# EAGLE design power (EAGLE 6.6.0)
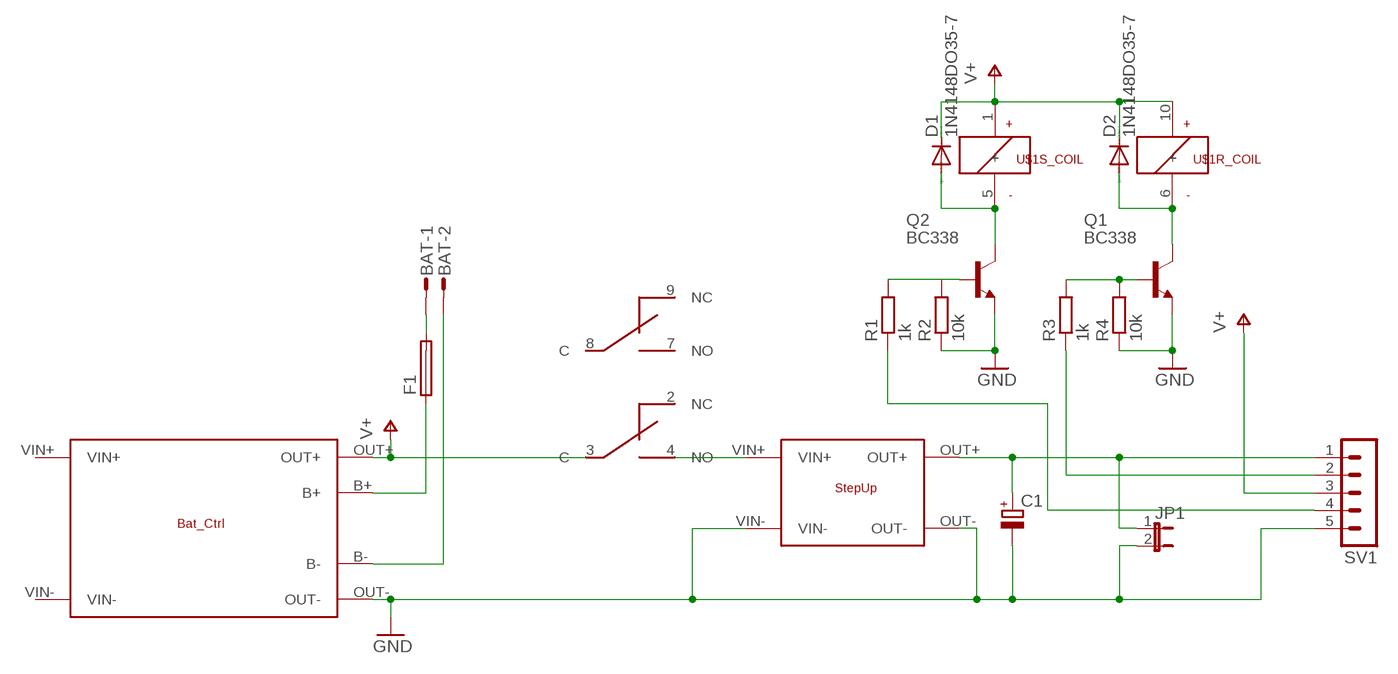
[diagram p0: schematic, sheet 1]

## Parts
BAT  S02P  [S02P]
C1  CPOL-EUE3.5-8  [E3,5-8]
D1  1N4148DO35-7  [DO35-7]
D2  1N4148DO35-7  [DO35-7]
F1  SH22,5  [SH22,5]
JP1  JP1E  [JP1]
Q1  BC338  [TO92-EBC]
Q2  BC338  [TO92-EBC]
R1  1k  R-EU_0204/7  [0204/7]
R2  10k  R-EU_M1206  [M1206]
R3  1k  R-EU_0204/7  [0204/7]
R4  10k  R-EU_M1206  [M1206]
SV1  MA05-1  [MA05-1]
U$1  EB2-4.5TNU  [10PIN_SMD_RELAY]
U$2  STEP_UP  [STEP_UP]
U$3  BAT_CTRL  [BAT_CONTR]

## Nets
GND: C1.- JP1.2 Q1.E Q2.E R2.1 R4.1 SV1.5 U$2.OUT- U$2.VIN- U$3.OUT-
N$1: D2.A Q1.C U$1.6(R_COIL:-)
N$2: D1.A Q2.C U$1.5(S_COIL:-)
N$3: Q2.B R1.2 R2.2
N$4: Q1.B R3.2 R4.2
N$5: BAT.1 F1.2
N$6: F1.1 U$3.B+
N$7: BAT.2 U$3.B-
N$8: U$1.4(SWITCH_TOP:NO) U$2.VIN+
N$9: C1.+ JP1.1 SV1.1 U$2.OUT+
N$11: R3.1 SV1.2
N$12: R1.1 SV1.4
V+: D1.C D2.C SV1.3 U$1.1(S_COIL:+) U$1.3(SWITCH_TOP:C) U$1.10(R_COIL:+) U$3.OUT+
Unconnected: U$1.2(SWITCH_TOP:NC) U$1.7(SWITCH_BOT:NO) U$1.8(SWITCH_BOT:C) U$1.9(SWITCH_BOT:NC) U$3.VIN+ U$3.VIN-

## Library data of the parts
BAT = con-amp-mt:S02P: AMP MT CONNECTOR; OC_FARNELL: unknown; OC_NEWARK: unknown
C1 = resistor:CPOL-EU: POLARIZED CAPACITOR, European symbol
D1 D2 = diode:1N4148: DIODE high speed (Philips)
F1 = fuse:SH22,5: FUSE HOLDER grid 22,5 mm, OGN0031 8201, Schurter (Buerklin); MF: SCHURTER; MPN: 0031.8201; OC_FARNELL: 1162740; OC_NEWARK: 96F8317
JP1 = jumper:JP1E: JUMPER
Q1 Q2 = transistor-npn:BC338*: NPN Transistor
R1-R4 = resistor:R-EU_: RESISTOR, European symbol
SV1 = con-lstb:MA05-1: PIN HEADER; OC_FARNELL: unknown; OC_NEWARK: unknown
U$1 = Mein_zeug:EB2-4.5TNU
U$2 = Mein_zeug:STEP_UP
U$3 = Mein_zeug:BAT_CTRL

## Board
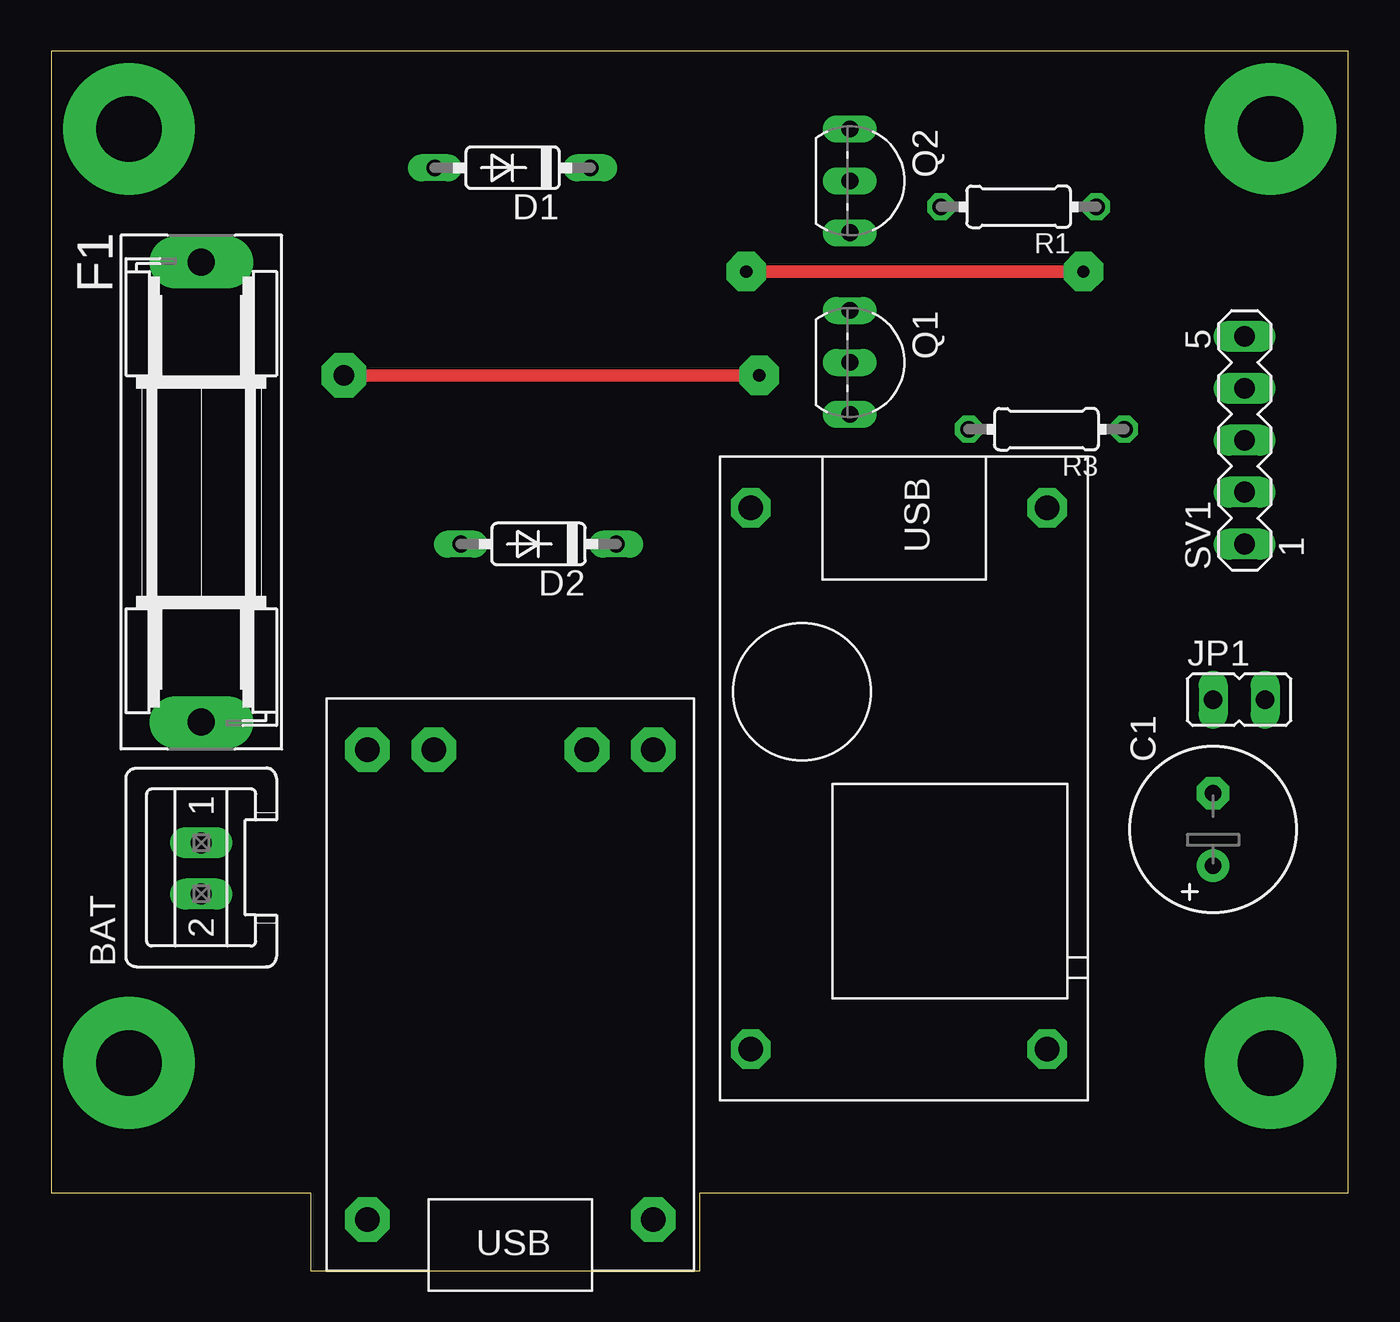
[diagram p1: board, top side]
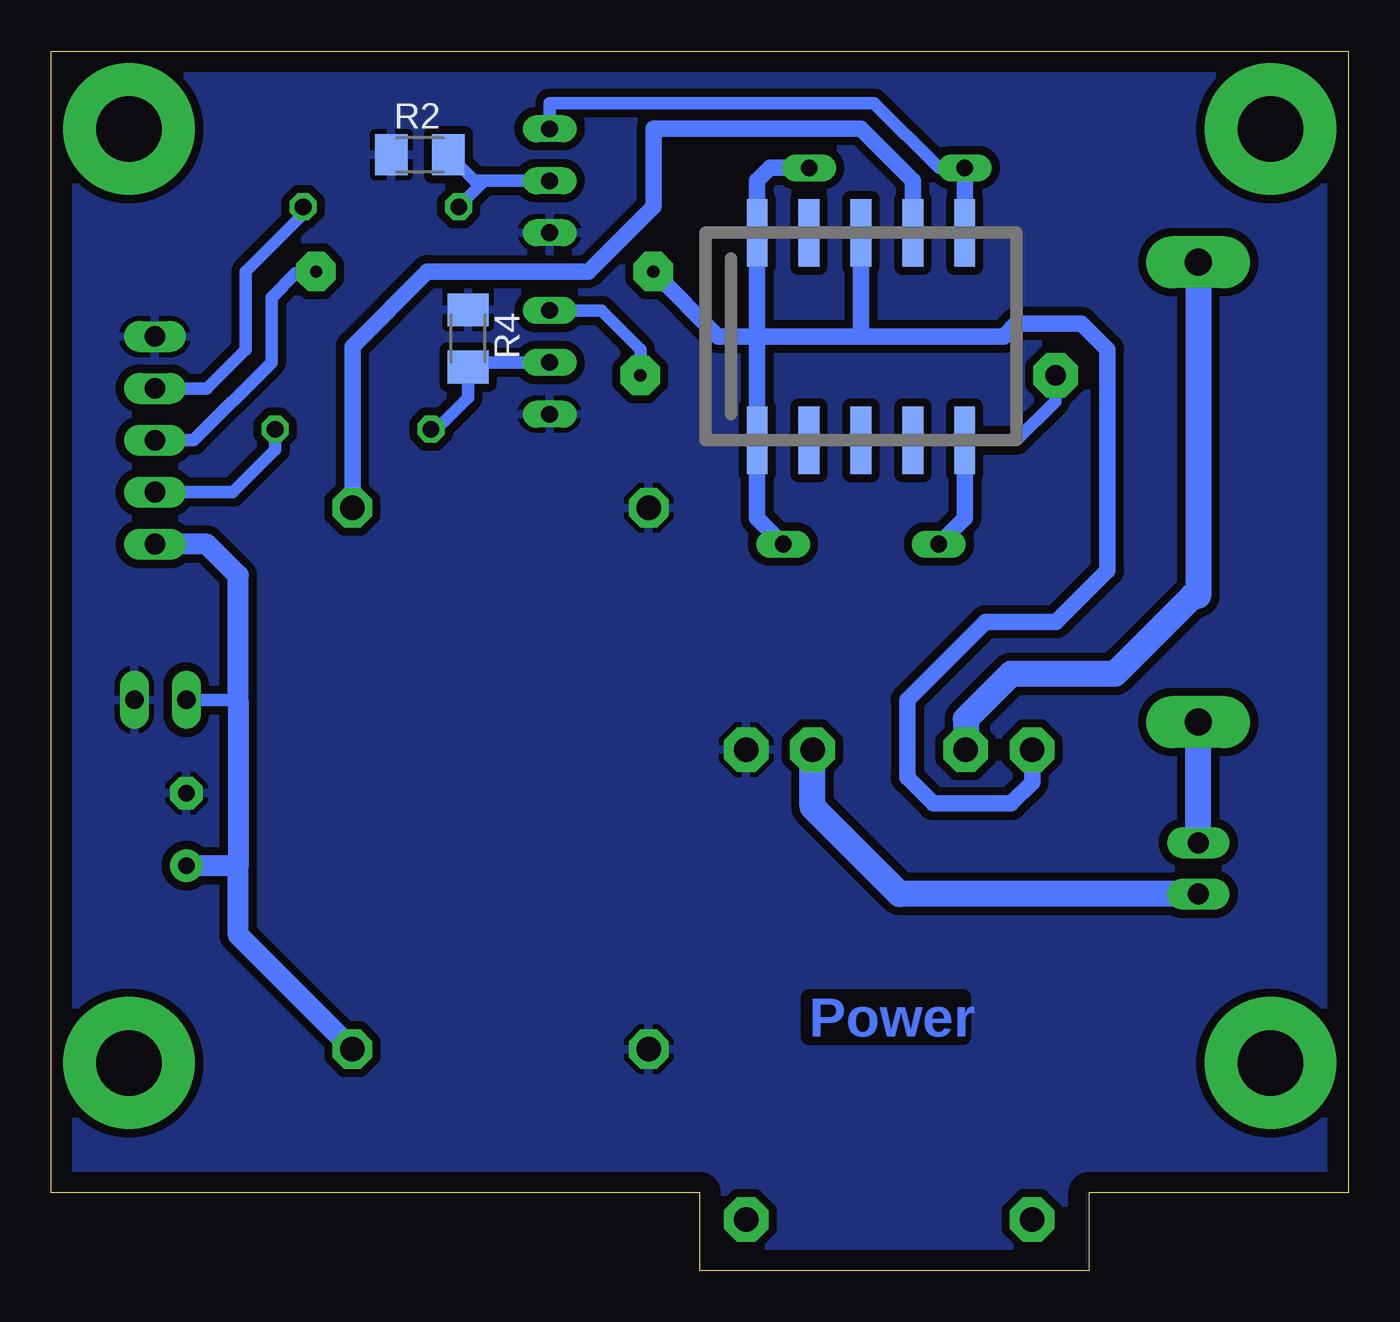
[diagram p2: board, bottom side, seen from below]

Size 63.5 x 59.69 mm. Coordinates in mm from the lower left corner, seen from the top.
Outline: 63.5,3.81 63.5,59.69 0,59.69 0,3.81 12.7,3.81 12.7,0 31.75,0 31.75,3.81 63.5,3.81
Copper layers (1*16): Top 0.035mm / dielectric 1.5mm / Bottom 0.035mm
Design rules "default": minimum track width 10mil, minimum drill 24mil, track to track 8mil, track to pad 8mil, pad to pad 8mil, via to via 8mil, smd to smd 8mil, copper to edge 40mil, drill to drill 8mil, minimum pad ring 10mil, minimum via ring 8mil, stop-mask expansion 4mil, vias tented up to drill 0mil, thermal gap 10mil

### Footprints (pad centres in the part's own frame; a part is rotated, then mirrored left to right if it is on the bottom)
S02P = drill 1.016 long: 1 1.25,0; 2 -1.25,0
E3,5-8 = drill 0.813 pad 1.6: + -1.778,0 | drill 0.813 pad 1.6 octagon: - 1.778,0
DO35-7 = drill 0.813 long: A 3.81,0; C -3.81,0
SH22,5 = drill 1.321 pad 2.54 long: 1 -11.252,0; 2 11.252,0
JP1 = drill 0.914 long: 1 0,-1.27; 2 0,1.27
TO92-EBC = drill 0.813 long: B 0,-1.27; C -2.54,-1.27; E 2.54,-1.27
0204/7 = drill 0.813 octagon: 1 -3.81,0; 2 3.81,0
M1206 = smd 1.6 x 2: 1 -1.4,0; 2 1.4,0
MA05-1 = drill 1.016 long: 1 -5.08,0; 2 -2.54,0; 3 0,0; 4 2.54,0; 5 5.08,0
10PIN_SMD_RELAY = smd 1.016 x 3.302: 1 -5.08,5.08; 2 -2.54,5.08; 3 0,5.08; 4 2.54,5.08; 5 5.08,5.08; 6 5.08,-5.08; 7 2.54,-5.08; 8 0,-5.08; 9 -2.54,-5.08; 10 -5.08,-5.08
STEP_UP = drill 1.2 pad 1.93 octagon: OUT+ 29,16; OUT- 29,1.5; VIN+ 2.5,16; VIN- 2.5,1.5
BAT_CONTR = drill 1.2 pad 2.184 octagon: B+ 25.5,12.75; B- 25.5,5.25; OUT+ 25.5,16; OUT- 25.5,2; VIN+ 2.5,16; VIN- 2.5,2

### Placement (x,y rotation side)
BAT  7.35,19.69 90 top
C1  56.88,21.59 90 top
D1  22.59,53.97 180 top
D2  23.86,35.56 180 top
F1  7.35,38.1 270 top
JP1  58.15,27.94 270 top
Q1  40.37,44.45 270 top
Q2  40.37,53.34 270 top
R1  47.36,52.07 180 top
R2  45.45,54.61 0 bottom
R3  48.72,41.18 180 top
R4  43.09,45.62 270 bottom
SV1  58.42,40.64 90 top
U$1  23.86,45.72 0 bottom
U$2  32.75,39.83 270 top
U$3  31.48,0 90 top

### Tracks (layer width: path | path; a pad name or v marks a point on that pad's centre or on a via)
GND
  pour Bottom (isolate 0.406): 0,0 63.5,0 63.5,59.69 0,59.69
N$1  (via drill 0.6 pad 1.93, 1 pad 2.18)
  Top 0.61: v34.66,43.81 v14.34,43.81
  Bottom 0.61: U$1.6 16.24,40.64 14.34,42.55 v14.34,43.81 | Q1.C 36.56,46.99 34.66,45.08 v34.66,43.81
  Bottom 0.813: U$1.6 18.78,36.83 D2.A
N$2
  Bottom 0.61: Q2.C 39.1,57.15 23.22,57.15 20.05,53.97 D1.A
  Bottom 0.813: U$1.5 D1.A
N$3
  Bottom 0.61: 42.28,53.34 Q2.B | 42.28,53.34 R1.2 | 42.28,53.34 42.78,53.34 R2.2
N$4
  Bottom 0.61: Q1.B 43.5,44.45 R4.2 43.09,42.72 44.63,41.18 R3.2
N$5
  Bottom 1.27: BAT.1 F1.2
N$6
  Bottom 1.27: F1.1 7.35,33.02 7.62,33.02 11.43,29.21 16.51,29.21 18.73,26.99 U$3.B+
N$7
  Bottom 1.27: U$3.B- 26.23,22.69 21.97,18.44 BAT.2
N$8
  Bottom 0.813: U$1.4 21.32,53.34 23.86,55.88 34.02,55.88 34.02,52.07 37.2,48.89 45.09,48.89 48.75,45.23 U$2.VIN+
N$9
  Bottom 0.61: JP1.1 54.34,27.94 54.34,27.81
  Bottom 1.016: 54.34,19.81 54.34,27.81 54.34,34.02 55.88,35.56 SV1.1 | 54.34,19.81 C1.+ | U$2.OUT+ 54.34,16.42 54.34,19.81
N$11
  Bottom 0.61: R3.1 52.53,40.18 54.61,38.1 SV1.2
N$12
  Bottom 0.61: SV1.4 55.88,43.18 53.98,45.08 53.98,48.89 51.16,51.7 R1.1
N$13  (via drill 3.2 pad 6.45)
  other vias: 3.81,10.16
N$14  (via drill 3.2 pad 6.45)
  other vias: 59.69,10.16
N$15  (via drill 3.2 pad 6.45)
  other vias: 3.81,55.88
N$17  (via drill 0.6 pad 1.93)
  other vias: 14.34,43.81
N$20  (via drill 3.2 pad 6.45)
  other vias: 59.69,55.88
V+  (via drill 0.6 pad 1.93)
  Top 0.61: v34.02,48.89 v50.53,48.89
  Bottom 0.61: 50.62,48.81 51.52,48.81 52.71,47.62 52.71,44.45 56.52,40.64 SV1.3
  Bottom 0.813: D2.C 28.94,36.83 U$1.10 28.94,45.72 | 28.94,45.72 U$1.1 28.94,53.34 28.3,53.97 D1.C | 23.86,45.72 28.94,45.72 | U$1.3 23.86,45.72 | 28.94,45.72 30.84,45.72 v34.02,48.89 | 23.86,45.72 16.88,45.72 16.24,46.36 13.07,46.36 11.79,45.08 11.79,34.27 14.31,31.75 17.78,31.75 21.59,27.94 21.59,24.13 20.32,22.86 16.51,22.86 15.48,23.89 U$3.OUT+ | 50.62,48.81 v50.53,48.89

### Text on the board
Bottom: Power